# Altium schematic sheet M62429_IIC_8声道音量控制.SchDoc
size A4
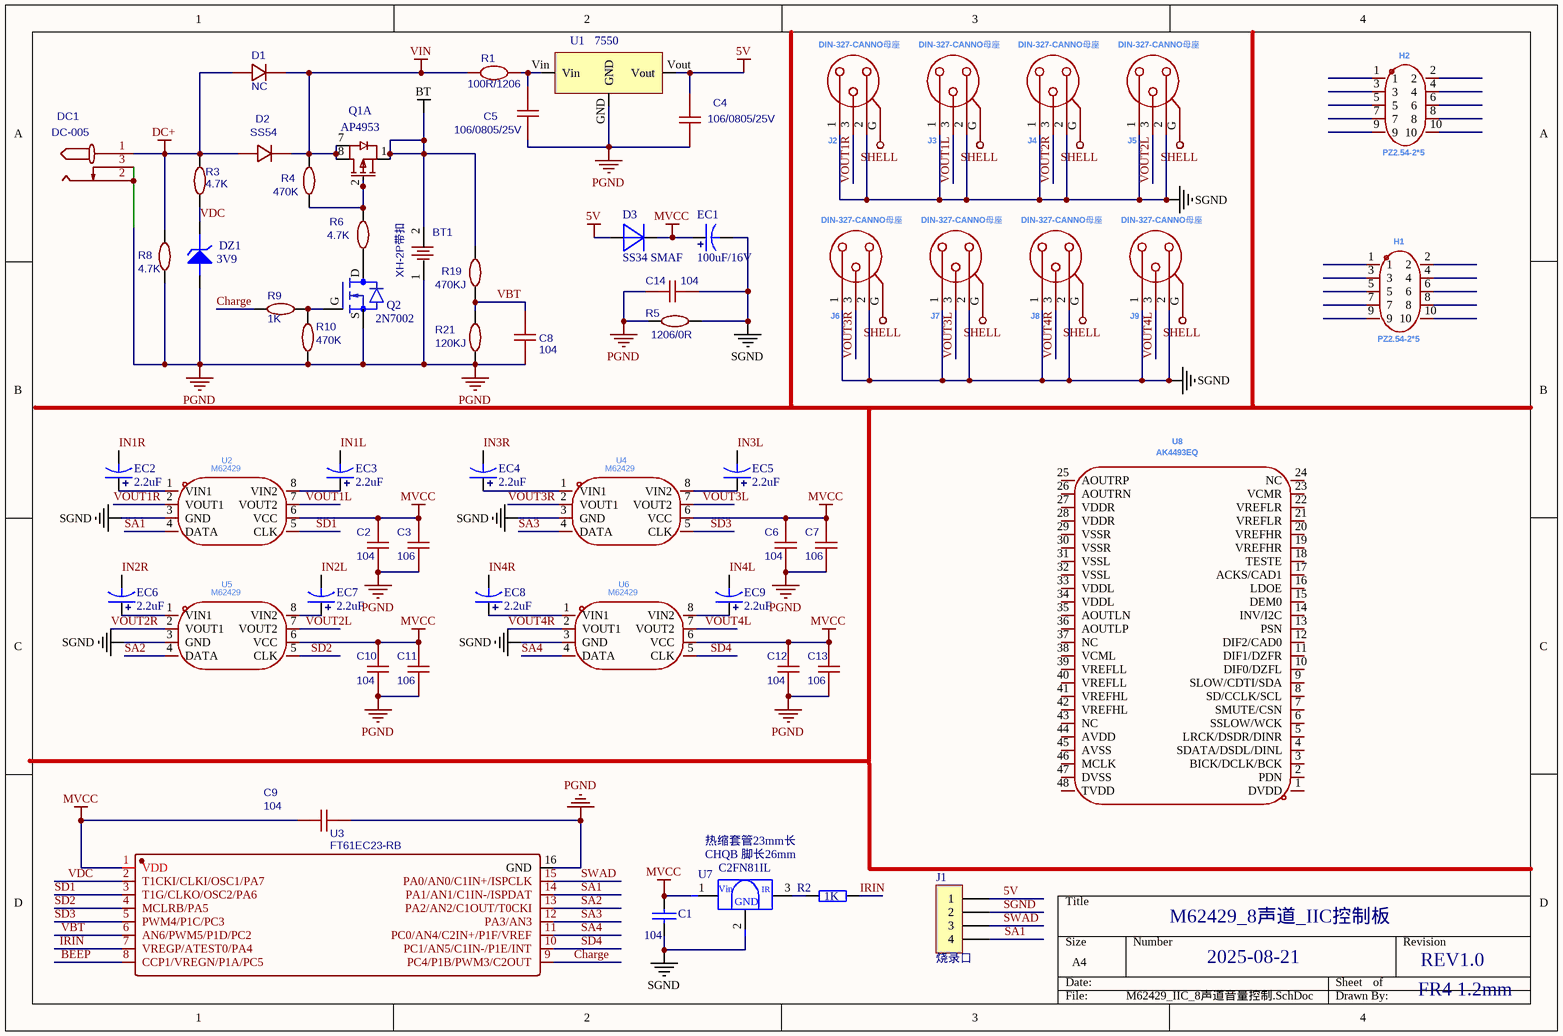
[diagram p0: M62429_IIC_8声道音量控制.SchDoc]

## Parts
BT1  XH-2P带扣  [MI-VHL2-2.5]
C1  104  [0603_C]
C2  104  [0805_c]
C3  106  [0805_c]
C4  106/0805/25V  [0805_c]
C5  106/0805/25V  [0805_c]
C6  104  [0805_c]
C7  106  [0805_c]
C8  104  [0603_C]
C9  104  [0603_C]
C10  104  [0805_c]
C11  106  [0805_c]
C12  104  [0805_c]
C13  106  [0805_c]
C14  104  [0603_C]
D1  NC  [SMA(DO-214AC)_S1]
D2  SS54  [SMA(DO-214AC)_S1]
D3  SS34 SMAF  [SMT-DO-214AC]
DC1  DC-005  [DC-005]
DZ1  3V9  [SMT-SOD123锡膏]
EC1  100uF/16V  [DIP-EC7-2.5]
EC2  2.2uF  [DIP-EC7-2.5]
EC3  2.2uF  [DIP-EC7-2.5]
EC4  2.2uF  [DIP-EC7-2.5]
EC5  2.2uF  [DIP-EC7-2.5]
EC6  2.2uF  [DIP-EC7-2.5]
EC7  2.2uF  [DIP-EC7-2.5]
EC8  2.2uF  [DIP-EC7-2.5]
EC9  2.2uF  [DIP-EC7-2.5]
H1  PZ2.54-2*5  [HDR-TH_10P-P2.54-V-M-R2-C5-S2.54-1]
H2  PZ2.54-2*5  [HDR-TH_10P-P2.54-V-M-R2-C5-S2.54-1]
J1  烧录口  [烧录口]
J2  DIN-327-CANNO母座  [CONN-TH_DIN-327]
J3  DIN-327-CANNO母座  [CONN-TH_DIN-327]
J4  DIN-327-CANNO母座  [CONN-TH_DIN-327]
J5  DIN-327-CANNO母座  [CONN-TH_DIN-327]
J6  DIN-327-CANNO母座  [CONN-TH_DIN-327]
J7  DIN-327-CANNO母座  [CONN-TH_DIN-327]
J8  DIN-327-CANNO母座  [CONN-TH_DIN-327]
J9  DIN-327-CANNO母座  [CONN-TH_DIN-327]
Q1  AP4953  (part A of 2)
Q2  2N7002  [SMT-MOS管-SOT23锡膏]
R1  100R/1206  [SMT-1206]
R2  1K  [0603_R]
R3  4.7K  [0603_R]
R4  470K  [0603_R]
R5  1206/0R  [0603_R]
R6  4.7K  [0603_R]
R8  4.7K  [0603_R]
R9  1K  [0603_R]
R10  470K  [0603_R]
R19  470KJ  [0603_R]
R21  120KJ  [0603_R]
U1  7550  [SMT-LDO-SOT23锡膏]
U2  M62429  [SOIC-8_L5.0-W4.0-P1.27-LS6.0-BL]
U3  FT61EC23-RB  [SOIC-16_150mil]
U4  M62429  [SOIC-8_L5.0-W4.0-P1.27-LS6.0-BL]
U5  M62429  [SOIC-8_L5.0-W4.0-P1.27-LS6.0-BL]
U6  M62429  [SOIC-8_L5.0-W4.0-P1.27-LS6.0-BL]
U7  C2FN81IL  [MI-红外接收头卧式]
U8  AK4493EQ  [LQFP-48_L7.0-W7.0-P0.50-LS9.0-BL]

## Nets
5V: C4.1 D3.1 J1.1 U1.Vout
BT: BT1.2 Q1.1(S) R19.2
DC+: D1.1 D2.1 DC1.1 R3.2 R8.2
MVCC: C1.2 C2.2 C3.2 C6.2 C7.2 C9.1 C10.2 C11.2 C12.2 C13.2 D3.2 EC1.1 U2.6(VCC) U3.1(VDD) U4.6(VCC) U5.6(VCC) U6.6(VCC) U7.1
PGND: BT1.1 C2.1 C3.1 C4.2 C5.2 C6.1 C7.1 C8.2 C9.2 C10.1 C11.1 C12.1 C13.1 C14.1 DC1.2 DC1.3 DZ1.1(A) Q2.S R5.2 R8.1 R10.2 R21.1 U1.GND U3.16(GND)
SGND: C1.1 C14.2 EC1.2 J1.2 J2.1 J2.2 J3.1 J3.2 J4.1 J4.2 J5.1 J5.2 J6.1 J6.2 J7.1 J7.2 J8.1 J8.2 J9.1 J9.2 R5.1 U2.3(GND) U4.3(GND) U5.3(GND) U6.3(GND) U7.2
SHELL: J2.G J3.G J4.G J5.G J6.G J7.G J8.G J9.G
VIN: D1.2 D2.2 Q1.7(D) Q1.8(D) R1.2 R4.2
BEEP: U3.8(CCP1/VREGN/P1A/PC5)
Charge: R9.2 U3.9(PC4/P1B/PWM3/C2OUT)
IN1L: EC3.2
IN1R: EC2.2
IN2L: EC7.2
IN2R: EC6.2
IN3L: EC5.2
IN3R: EC4.2
IN4L: EC9.2
IN4R: EC8.2
IRIN: R2.2 U3.7(VREGP/ATEST0/PA4)
SA1: J1.4 U2.4(DATA) U3.14(PA1/AN1/C1IN-/ISPDAT)
SA2: U3.13(PA2/AN2/C1OUT/T0CKI) U5.4(DATA)
SA3: U3.12(PA3/AN3) U4.4(DATA)
SA4: U3.11(PC0/AN4/C2IN+/P1F/VREF) U6.4(DATA)
SD1: U2.5(CLK) U3.3(T1G/CLKO/OSC2/PA6)
SD2: U3.4(MCLRB/PA5) U5.5(CLK)
SD3: U3.5(PWM4/P1C/PC3) U4.5(CLK)
SD4: U3.10(PC1/AN5/C1IN-/P1E/INT) U6.5(CLK)
SWAD: J1.3 U3.15(PA0/AN0/C1IN+/ISPCLK)
VBT: C8.1 R19.1 R21.2 U3.6(AN6/PWM5/P1D/PC2)
VDC: DZ1.2(K) R3.1 U3.2(T1CKI/CLKI/OSC1/PA7)
VOUT1L: J3.3 U2.7(VOUT2)
VOUT1R: J2.3 U2.2(VOUT1)
VOUT2L: J5.3 U5.7(VOUT2)
VOUT2R: J4.3 U5.2(VOUT1)
VOUT3L: J7.3 U4.7(VOUT2)
VOUT3R: J6.3 U4.2(VOUT1)
VOUT4L: J9.3 U6.7(VOUT2)
VOUT4R: J8.3 U6.2(VOUT1)
NetC5_1: C5.1 R1.1 U1.Vin
NetEC2_1: EC2.1 U2.1(VIN1)
NetEC3_1: EC3.1 U2.8(VIN2)
NetEC4_1: EC4.1 U4.1(VIN1)
NetEC5_1: EC5.1 U4.8(VIN2)
NetEC6_1: EC6.1 U5.1(VIN1)
NetEC7_1: EC7.1 U5.8(VIN2)
NetEC8_1: EC8.1 U6.1(VIN1)
NetEC9_1: EC9.1 U6.8(VIN2)
NetQ1_2: Q1.2(G) R4.1 R6.2
NetQ2_D: Q2.D R6.1
NetQ2_G: Q2.G R9.1 R10.1
NetR2_1: R2.1 U7.3

Not connected (* = marked no-connect by the designer): H1 1 2 3 4 5 6 7 8 9 10; H2 1 2 3 4 5 6 7 8 9 10; U8 1(DVDD) 2(PDN) 3(BICK/DCLK/BCK) 4(SDATA/DSDL/DINL) 5(LRCK/DSDR/DINR) 6(SSLOW/WCK) 7(SMUTE/CSN) 8(SD/CCLK/SCL) 9(SLOW/CDTI/SDA) 10(DIF0/DZFL) 11(DIF1/DZFR) 12(DIF2/CAD0) 13(PSN) 14(INV/I2C) 15(DEM0) 16(LDOE) 17(ACKS/CAD1) 18(TESTE) 19(VREFHR) 20(VREFHR) 21(VREFLR) 22(VREFLR) 23(VCMR) 24(NC) 25(AOUTRP) 26(AOUTRN) 27(VDDR) 28(VDDR) 29(VSSR) 30(VSSR) 31(VSSL) 32(VSSL) 33(VDDL) 34(VDDL) 35(AOUTLN) 36(AOUTLP) 37(NC) 38(VCML) 39(VREFLL) 40(VREFLL) 41(VREFHL) 42(VREFHL) 43(NC) 44(AVDD) 45(AVSS) 46(MCLK) 47(DVSS) 48(TVDD)

## Notes on the sheet
- 热缩套管23mm长
- (near U7) CHQB 脚长26mm
- M62429_8声道_IIC控制板
- 2025-08-21
- REV1.0
- FR4 1.2mm
- (in symbol 红外接收头) Vin; IR; GND

## Library data of the parts
BT1 = 12V: BOM_Manufacturer: Q&J; BOM_Manufacturer Part: CR1220-2; BOM_Supplier: LCSC; image: //image.lceda.cn/szlcsc/C70381.jpg; BOM_Supplier Part: C70381; spicePre: B; spiceSymbolName: CR1220-2
C1 = CAP
C2-C14 = 0.1u: nameAlias: Value(F); Contributor: LCEDA_Lib; spicePre: C; spiceSymbolName: C_0603_US
D1 D2 = SS24: BOM_Manufacturer: SEMTECH; BOM_Manufacturer Part: 1N4007; Contributor: czy418; BOM_Supplier: LCSC; BOM_Supplier Part: C106903; spicePre: D; spiceSymbolName: 1N4007
D3 = Diode
DC1 = DC-022-A1: BOM_Manufacturer: HRO; BOM_Supplier: LCSC; BOM_Manufacturer Part: DC-022-A1; BOM_Supplier Part: C92635; spicePre: D; spiceSymbolName: DC-022-A1
DZ1 = DIODE ZENER: 稳压二极管
EC1-EC9 = SMD_ECAP: 贴片电解电容
H1 H2 = PZ2.54-2*5: Manufacturer: ZHOURI(洲日); Add into BOM: yes; Pin Structure: 2x5P; Pitch: 2.54mm; Symbol: PZ2.54-2*5; Device: PZ2.54-2*5; LCSC Part Name: PZ2.54-2*5; Supplier Part: C5156677; Manufacturer Part: PZ2.54-2*5; Supplier Footprint: 插件,P=2.54mm; JLCPCB Part Class: Extended Part; Datasheet: https://atta.szlcsc.com/upload/public/pdf/source/20220923/FF9D303E4B04AC19FF78D5B876650950.pdf; Supplier: LCSC; Convert to PCB: yes; Number of Rows: 双排; Number of Pins: 10P
J1 = VH4
J2-J9 = DIN-327: Manufacturer: HOOYA(皓宇电子); Add into BOM: yes; Symbol: DIN-327; Device: DIN-327; LCSC Part Name: DIN-327; Supplier Part: C309324; Manufacturer Part: DIN-327; Supplier Footprint: 插件; JLCPCB Part Class: Extended Part; Datasheet: https://atta.szlcsc.com/upload/public/pdf/source/20181226/C309324_B155494179256B65E8987AB4B6F75F27.pdf; Supplier: LCSC; Convert to PCB: yes
Q1 = 2PMOS
Q2 = N MOS
R1 = 1k: Contributor: LCEDA_Lib; spicePre: R; spiceSymbolName: R_0603_EU
R2 = RES
R3-R6 R8-R10 R19 R21 = 51K: BOM_Manufacturer: UniOhm; BOM_Manufacturer Part: 0402WGJ0165TCE; nameAlias: Resistance (Ohms); BOM_Supplier: LCSC; BOM_Supplier Part: C57065; spicePre: R; spiceSymbolName: 0402WGJ0165TCE
U1 = IC ME6208
U2 U4-U6 = M62429: Manufacturer: I-CORE(中微爱芯); Add into BOM: yes; Symbol: M62429; Device: M62429; LCSC Part Name: M62429; Supplier Part: C668665; Manufacturer Part: M62429; Supplier Footprint: SOP-8; JLCPCB Part Class: Extended Part; Datasheet: https://atta.szlcsc.com/upload/public/pdf/source/20200618/C668665_3A9FF9CF0E5DC2AAD367A1236CAD10D9.pdf; Supplier: LCSC; Convert to PCB: yes
U3 = FT61FC23-RB: Contributor: lcsc; BOM_Supplier: LCSC; BOM_Supplier Part: C2984838; BOM_Manufacturer Part: FT61FC23-RB; BOM_JLCPCB Part Class: Extended Part; spicePre: U; spiceSymbolName: FT61FC23-RB
U7 = 红外接收头
U8 = AK4493EQ: Manufacturer: AKM; Add into BOM: yes; Symbol: AK4493EQ; Device: AK4493EQ; LCSC Part Name: AK4493EQ; Supplier Part: C1520741; Manufacturer Part: AK4493EQ; Supplier Footprint: LQFP-48(7x7); JLCPCB Part Class: Extended Part; Datasheet: https://atta.szlcsc.com/upload/public/pdf/source/20221101/09F447CC69052706ED74B41EB96CC08F.pdf; Supplier: LCSC; Convert to PCB: yes